# Altium schematic sheet BSPD.SchDoc: BSPD
size A3; DocumentNumber: 2; Revision: R5; SheetNumber: 2
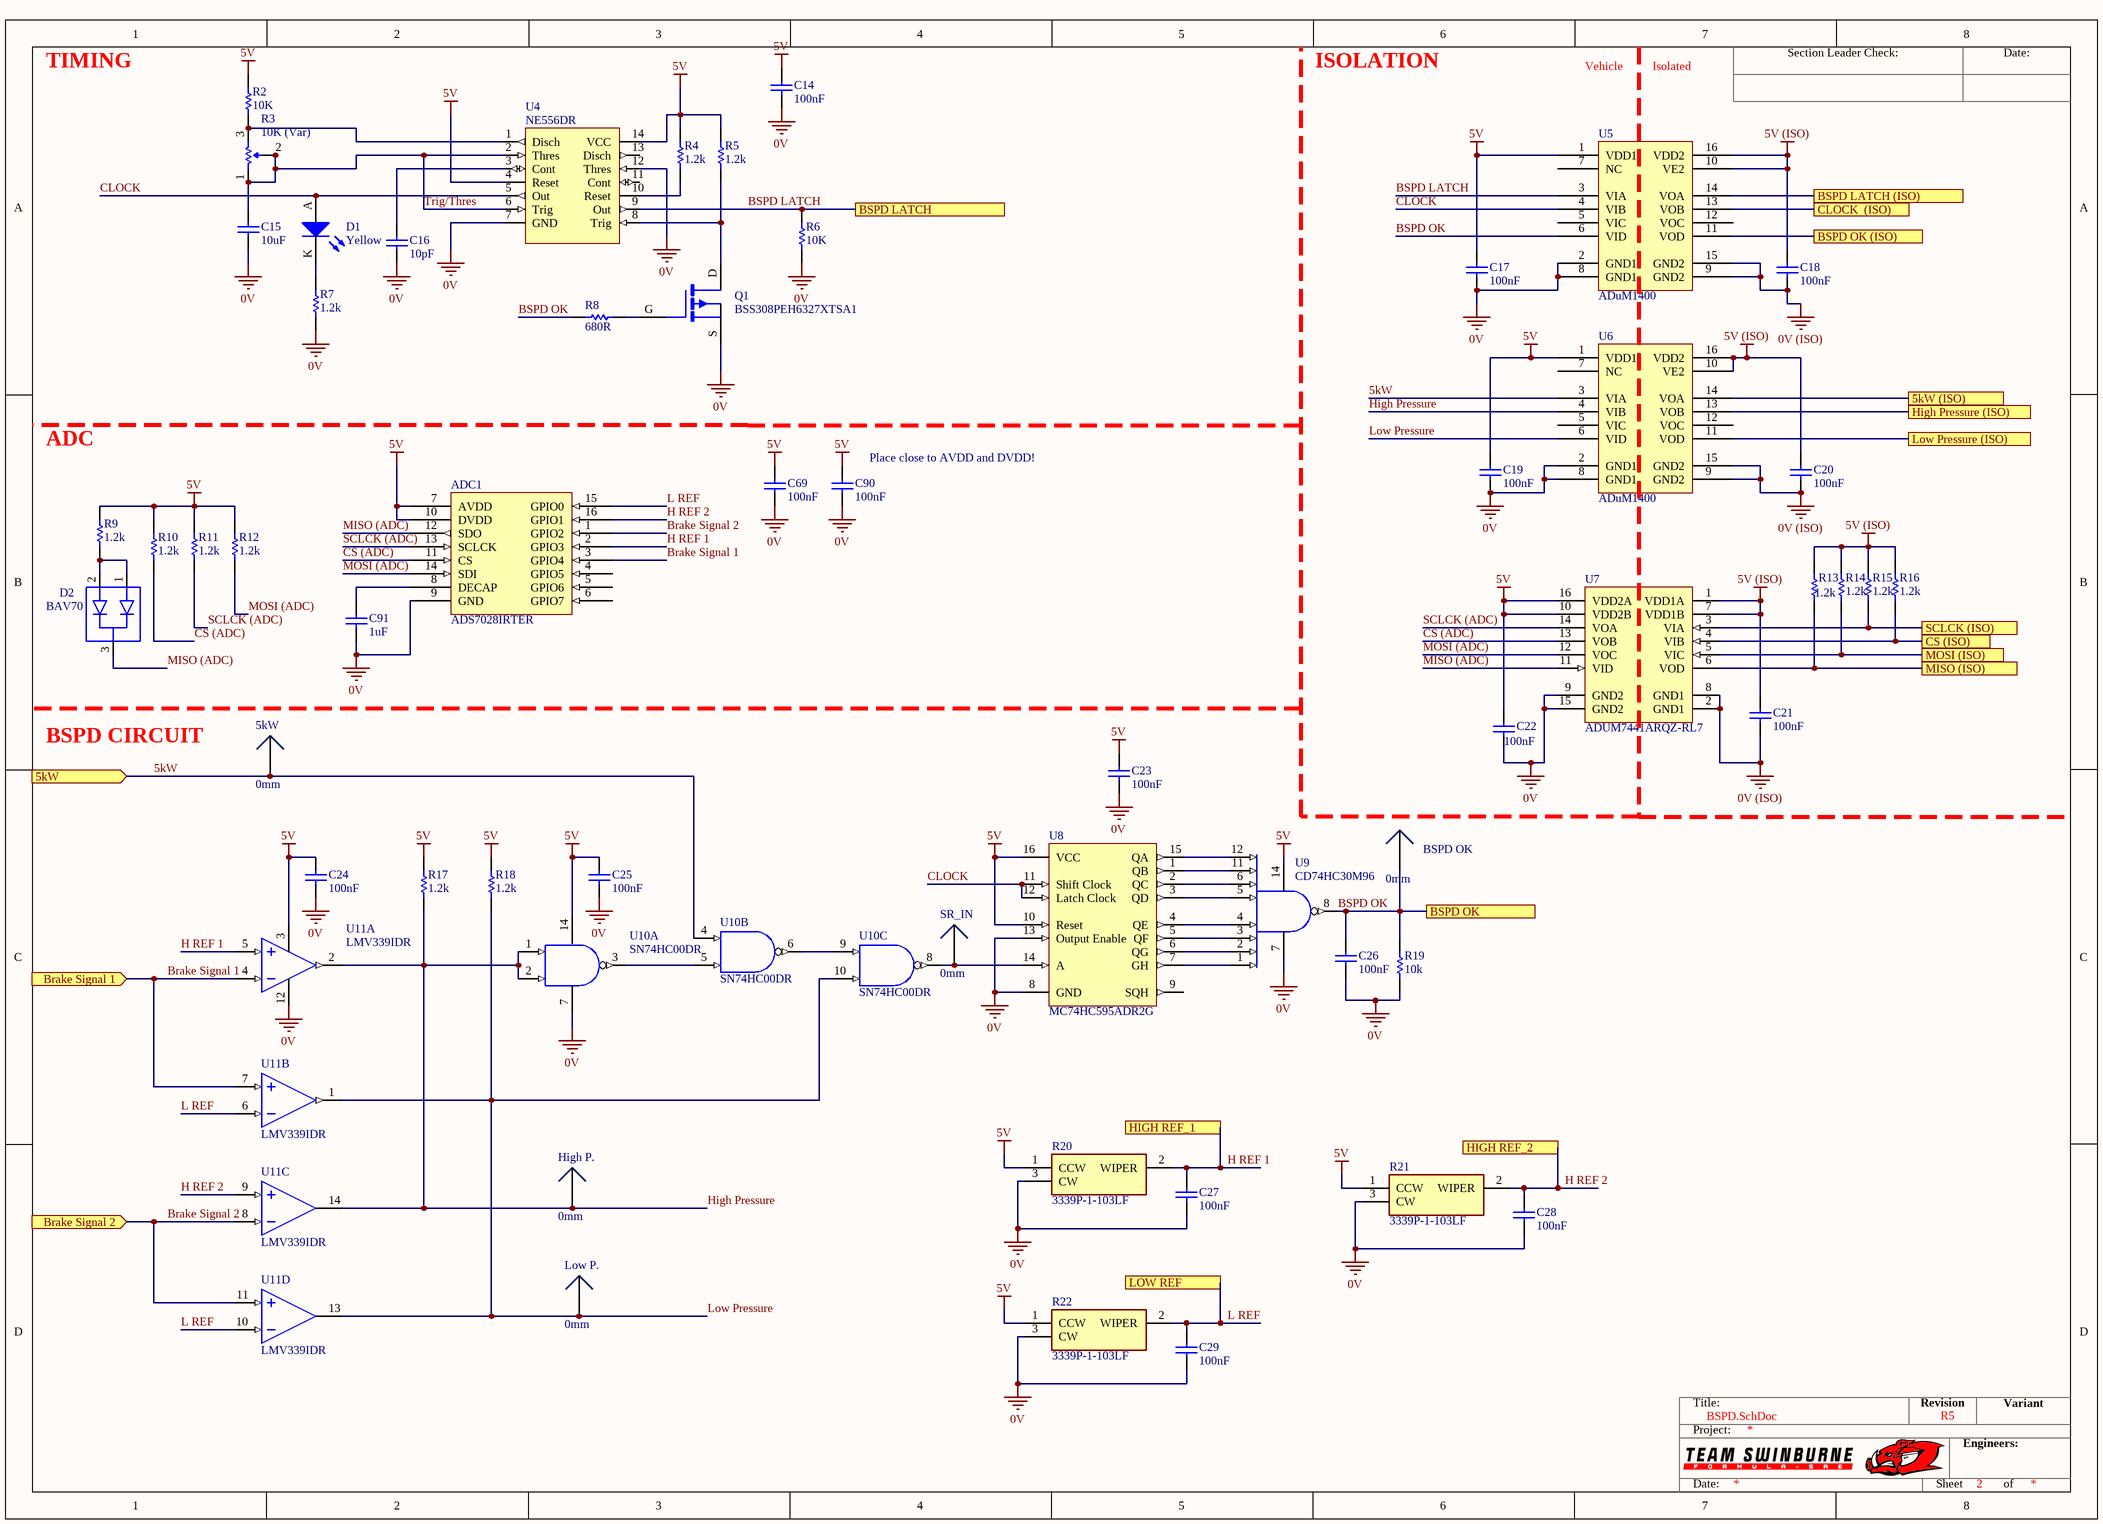
[diagram p0: BSPD.SchDoc]

## Parts
5kW  0mm  [SMD Test Point]
ADC1  ADS7028IRTER  [WFQN-16]
BSPD_OK  0mm  [SMD Test Point]
C14  100nF  [C0603]
C15  10uF  [C0603]
C16  10pF  [C0603]
C17  100nF  [C0603]
C18  100nF  [C0603]
C19  100nF  [C0603]
C20  100nF  [C0603]
C21  100nF  [C0603]
C22  100nF  [C0603]
C23  100nF  [C0603]
C24  100nF  [C0603]
C25  100nF  [C0603]
C26  100nF  [C0603]
C27  100nF  [0805]
C28  100nF  [0805]
C29  100nF  [0805]
C69  100nF  [C0603]
C90  100nF  [C0603]
C91  1uF  [0603]
D1  Yellow  [0805 LED]
D2  BAV70  [BAV70-Footprint-1]
High_P.  0mm  [SMD Test Point]
Low_P.  0mm  [SMD Test Point]
Q1  BSS308PEH6327XTSA1  [IN SOT-23 MOSFET]
R2  10K  [R0603]
R3  10K (Var)  [B 3296]
R4  1.2k  [R0603]
R5  1.2k  [R0603]
R6  10K  [R0603]
R7  1.2k  [R0603]
R8  680R  [R0603]
R9  1.2k  [R0603]
R10  1.2k  [R0603]
R11  1.2k  [R0603]
R12  1.2k  [R0603]
R13  1.2k  [R0603]
R14  1.2k  [R0603]
R15  1.2k  [R0603]
R16  1.2k  [R0603]
R17  1.2k  [R0603]
R18  1.2k  [R0603]
R19  10k  [0805]
R20  3339P-1-103LF  [3339P1103LF]
R21  3339P-1-103LF  [3339P1103LF]
R22  3339P-1-103LF  [3339P1103LF]
SR_IN  0mm  [SMD Test Point]
U4  NE556DR  [14 SOIC]
U5  ADuM1400  [SOIC16-W]
U6  ADuM1400  [SOIC16-W]
U7  ADUM7441ARQZ-RL7  [ADI-RQ-16_M]
U8  MC74HC595ADR2G  [ON 16-SOIC]
U9  CD74HC30M96  [TI 14-SOIC]
U10  SN74HC00DR  [TI 14-SOIC]  (parts A,B,C of 4)
U11  LMV339IDR  [TI 14-SOIC]  (parts A,B,C,D of 4)

## Ports
5kW (in), 5kW (ISO), Brake Signal 1 (in), Brake Signal 2 (in), BSPD LATCH, BSPD LATCH (ISO), BSPD OK, BSPD OK (ISO), CLOCK  (ISO), CS (ISO), High Pressure (ISO), HIGH REF_1, HIGH REF_2, Low Pressure (ISO), LOW REF, MISO (ISO), MOSI (ISO), SCLCK (ISO)

## Nets
0V: ADC1.9(GND) C14.1 C15.1 C16.1 C17.1 C19.1 C22.1 C23.1 C24.1 C25.1 C26.1 C27.1 C28.1 C29.1 C69.1 C90.1 C91.1 Q1.S R6.1 R7.1 R19.1 R20.3(CW) R21.3(CW) R22.3(CW) U4.7(GND) U4.12(Thres) U5.2(GND1) U5.8(GND1) U6.2(GND1) U6.8(GND1) U7.9(GND2) U7.15(GND2) U8.8(GND) U8.13(Output_Enable) U9.7(GND) U10.7(GND) U11.12(V-)
0V (ISO): C18.1 C20.1 C21.1 U5.9(GND2) U5.15(GND2) U6.9(GND2) U6.15(GND2) U7.2(GND1) U7.8(GND1)
5V: ADC1.7(AVDD) ADC1.10(DVDD) C14.2 C17.2 C19.2 C22.2 C23.2 C24.2 C25.2 C69.2 C90.2 R2.2 R4.2 R5.2 R9.2 R10.2 R11.2 R12.2 R17.2 R18.2 R20.1(CCW) R21.1(CCW) R22.1(CCW) U4.4(Reset) U4.14(VCC) U5.1(VDD1) U6.1(VDD1) U7.10(VDD2B) U7.16(VDD2A) U8.10(Reset) U8.16(VCC) U9.14(VCC) U10.14(VCC) U11.3(V+)
5V (ISO): C18.2 C20.2 C21.2 R13.2 R14.2 R15.2 R16.2 U5.10(VE2) U5.16(VDD2) U6.10(VE2) U6.16(VDD2) U7.1(VDD1A) U7.7(VDD1B)
5kW: 5kW.1 U6.3(VIA) U10.4(2A) ; port 5kW
5kW (ISO): U6.14(VOA) ; port 5kW (ISO)
Brake Signal 1: ADC1.3(GPIO4) U11.4(IN_A-) U11.7(IN_B+) ; port Brake Signal 1
Brake Signal 2: ADC1.1(GPIO2) U11.8(IN_C-) U11.11(IN_D+) ; port Brake Signal 2
BSPD LATCH: R6.2 U4.9(Out) U5.3(VIA) ; port BSPD LATCH
BSPD LATCH (ISO): U5.14(VOA) ; port BSPD LATCH (ISO)
BSPD OK: BSPD_OK.1 C26.2 R8.1 R19.2 U5.6(VID) U9.8(Output) ; port BSPD OK
BSPD OK (ISO): U5.11(VOD) ; port BSPD OK (ISO)
CLOCK: D1.A U4.5(Out) U5.4(VIB) U8.11(Shift_Clock) U8.12(Latch_Clock)
CLOCK  (ISO): U5.13(VOB) ; port CLOCK  (ISO)
CS (ADC): ADC1.11(CS) R10.1 U7.13(VOB)
CS (ISO): R16.1 U7.4(VIB) ; port CS (ISO)
H REF 1: ADC1.2(GPIO3) C27.2 R20.2(WIPER) U11.5(IN_A+) ; port HIGH REF_1
H REF 2: ADC1.16(GPIO1) C28.2 R21.2(WIPER) U11.9(IN_C+) ; port HIGH REF_2
High Pressure: High_P..1 R17.1 U6.4(VIB) U10.1(1A) U10.2(1B) U11.2(OUT_A) U11.14(OUT_C)
High Pressure (ISO): U6.13(VOB) ; port High Pressure (ISO)
L REF: ADC1.15(GPIO0) C29.2 R22.2(WIPER) U11.6(IN_B-) U11.10(IN_D-) ; port LOW REF
Low Pressure: Low_P..1 R18.1 U6.6(VID) U10.10(3B) U11.1(OUT_B) U11.13(OUT_D)
Low Pressure (ISO): U6.11(VOD) ; port Low Pressure (ISO)
MISO (ADC): ADC1.12(SDO) D2.3(CC) U7.11(VID)
MISO (ISO): R13.1 U7.6(VOD) ; port MISO (ISO)
MOSI (ADC): ADC1.14(SDI) R12.1 U7.12(VOC)
MOSI (ISO): R14.1 U7.5(VIC) ; port MOSI (ISO)
SCLCK (ADC): ADC1.13(SCLCK) R11.1 U7.14(VOA)
SCLCK (ISO): R15.1 U7.3(VIA) ; port SCLCK (ISO)
Trig/Thres: C15.2 R3.1(CCW) R3.2(Wiper) U4.2(Thres) U4.6(Trig)
NetADC1_8: ADC1.8(DECAP) C91.2
NetC16_2: C16.2 U4.3(Cont)
NetD1_K: D1.K R7.2
NetD2_1: D2.1(A1) D2.2(A2) R9.1
NetQ1_D: Q1.D R5.1 U4.8(Trig)
NetQ1_G: Q1.G R8.2
NetR2_1: R2.1 R3.3(CW) U4.1(Disch)
NetR4_1: R4.1 U4.10(Reset)
NetSR_IN_1: SR_IN.1 U8.14(A) U10.8(3Y)
NetU8_1: U8.1(QB) U9.11(Input)
NetU8_2: U8.2(QC) U9.6(Input)
NetU8_3: U8.3(QD) U9.5(Input)
NetU8_4: U8.4(QE) U9.4(Input)
NetU8_5: U8.5(QF) U9.3(Input)
NetU8_6: U8.6(QG) U9.2(Input)
NetU8_7: U8.7(GH) U9.1(Input)
NetU8_15: U8.15(QA) U9.12(Input)
NetU10_3: U10.3(1Y) U10.5(2B)
NetU10_6: U10.6(2Y) U10.9(3A)

Not connected (* = marked no-connect by the designer): ADC1 4(GPIO5) 5(GPIO6) 6(GPIO7); U4 11(Cont) 13(Disch); U5 5(VIC) 7(NC) 12(VOC); U6 5(VIC) 7(NC) 12(VOC); U8 9(SQH)

## Notes on the sheet
- TIMING
- ISOLATION
- Vehicle
- Isolated
- ADC
- (near C90) Place close to AVDD and DVDD!
- BSPD CIRCUIT
- Section Leader Check:
- Date:
- Title:
- Revision
- Variant
- Project:
- Engineers:
- Sheet
- of

## Library data of the parts
5kW BSPD_OK High_P. Low_P. SR_IN = SMD Test Point: Positions: 1; Row Spacing: 0; Flange: No; Contact: NA; Part Number: SMD Test Point; Pitch: 0mm; Angle: 0
ADC1 = ADS7028IRTER: IC ADC 12BIT SAR 16WQFN; Manufacturer: Texas Instruments; Part Number: ADS7028IRTER; Digikey Part Number: ADS7028IRTER; Digikey Link: https://www.digikey.com.au/en/products/detail/texas-instruments/ADS7028IRTER/12696020?s=N4IgTCBcDaIIIBEDKB2ADGAHASQEoBUBRXEAXQF8g
C14 C17-C26 C69 C90 = CC0603ZPY5V9BB104: Tolerance: 5%; Material: C0G; Rated Voltage: 50V; Part Number: CC0603ZPY5V9BB104; Value: 100nF; Digikey Link: #https://www.digikey.com.au/en/products/detail/yageo/CC0603ZPY5V9BB104/11490657#
C15 = GRM188R6YA106MA73D: Tolerance: 20%; Material: X5R; Rated Voltage: 35V; Part Number: GRM188R6YA106MA73D; Value: 10uF; Digikey Link: #https://www.digikey.com.au/en/products/detail/murata-electronics/GRM188R6YA106MA73D/5877411#
C16 = CC0603JPNPO9BN100: Tolerance: 5%; Material: C0G; Rated Voltage: 50V; Part Number: CC0603JPNPO9BN100; Value: 10pF; Digikey Link: #https://www.digikey.com.au/en/products/detail/yageo/CC0603JPNPO9BN100/11491009#
C27-C29 = GCM21BR71H104KA37L: Manufacturer: muRata; Tolerance: ±10%; Material: X7R; Rated Voltage: 50V; Part Number: GCM21BR71H104KA37L; Value: 100nF; Digikey Part Number: 490-6064-1-ND
C91 = GRT188R61H105ME13D: Manufacturer: muRata; Tolerance: 20%; Material: X5R; Rated Voltage: 50V; Part Number: GRT188R61H105ME13D; Value: 1uF; Digikey Part Number: GRT188R61H105ME13D
D1 = SML-211YTT86: Yellow LED Indication - Discrete 1.75V 0805 (2012 Metric); Manufacturer: ROHM Semiconductor; Part Number: SML-211YTT86; Colour: Yellow; Digikey Part Number: 511-1293-1-ND; Digikey Link: https://www.digikey.com/product-detail/en/rohm-semiconductor/SML-211YTT86/511-1293-1-ND/637106
D2 = CMP-004-00001-1: DIODE ARRAY GP 70V 200mA SOT23-3; RoHS Compliant: No
Q1 = BSS308PEH6327XTSA1: P-Channel 30V 2A (Ta) 500mW (Ta) Surface Mount SOT-23-3; Manufacturer: Infineon Technologies; Published: 24-Mar-1999; LatestRevisionDate: 29-May-2009; LatestRevisionNote: IPC-7351 Footprint Added.; PackageVersion: Sep-2000; PackageReference: SOT-343; Publisher: Altium Limited; PackageDescription: 4-Pin SOT-343 Package 1.3 mm Pitch, 2.1 mm Lead Span; Part Number: BSS308PEH6327XTSA1; Digikey Part Number: BSS308PEH6327XTSA1CT-ND; Digikey Link: https://www.digikey.com/product-detail/en/infineon-technologies/BSS308PEH6327XTSA1/BSS308PEH6327XTSA1CT-ND/3196649
R2 R6 = RA73F1J10KBTD: Tolerance: 0.1%; Part Number: RA73F1J10KBTD; Value: 10K; Material: Thin Film; Digikey Link: #https://www.digikey.com.au/en/products/detail/te-connectivity-passive-product/RA73F1J10KBTD/16031729#
R3 = 3296W-1-103LF: Manufacturer: Bournes Inc; Tolerance: 0.1; Rated Voltage: 0.5W; Part Number: 3296W-1-103LF; Value: 10K (Var); Digikey Part Number: 3296W-103LF-ND
R4 R5 R7 R9-R18 = ERJ-PA3J122V: Tolerance: 1%; Part Number: ERJ-PA3J122V; Value: 1.2k; Material: Thick Film; Digikey Link: #https://www.digikey.com.au/en/products/detail/panasonic-electronic-components/ERJ-PA3J122V/5035981#
R8 = RCP0603B680RGEA: Tolerance: 2%; Part Number: RCP0603B680RGEA; Value: 680R; Material: Thick Film; Digikey Link: #https://www.digikey.com.au/en/products/detail/vishay-dale/RCP0603B680RGEA/5791729#
R19 = RC0805FR0710KL: Manufacturer: YAGEO; Tolerance: 0.01; Rated Voltage: 0.125W; Part Number: RC0805FR0710KL; Value: 10k; Material: FR-07; Digikey Part Number: 311-10.0KCRCT-ND
R20-R22 = 3339P-1-103LF: Variable Resistor; Manufacturer_Name: Bourns; Datasheet Link: http://www.bourns.com/docs/Product-Datasheets/3339.pdf; Height: 6.6mm; Manufacturer_Part_Number: 3339P-1-103LF; Mouser Part Number: 652-3339P-1-103LF; Mouser Price/Stock: https://www.mouser.co.uk/ProductDetail/Bourns/3339P-1-103LF?qs=pSi0RBzb0oq3DckZs1IQyg%3D%3D; Arrow Part Number: 3339P-1-103LF; Arrow Price/Stock: https://www.arrow.com/en/products/3339p-1-103lf/bourns?region=nac
U4 = NE556DR: IC OSC TIMER DUAL 100KHZ 14SOIC; Manufacturer: Texas Instruments; Part Number: NE556DR; Digikey Part Number: 296-26240-1-ND; Digikey Link: https://www.digikey.com/product-detail/en/texas-instruments/NE556DR/296-26240-1-ND/2254905
U5 U6 = ADuM1400: DIGITAL ISOLATOR, QUAD CHANNEL; Part Number: ADuM1400; Digikey Link: #https://www.analog.com/media/en/technical-documentation/data-sheets/ADuM1400_1401_1402.pdf#
U7 = CMP-001-0005-5: Digital Isolator CMOS 4-CH 1Mbps 16-Pin QSOP T/R; Pulse Width Distortion (PWD): 25ns; Nominal Supply Current: 4.1mA; Data Rate: 25Mbps; Turn-On Delay Time: 56ns; Max Supply Voltage: 5.5V; Isolated Power: No; Min Supply Voltage: 3V; Propagation Delay: 75ns; Channel Type: Unidirectional; Number of Channels: 4; Lead Free: Contains Lead; Number of Pins: 16; Contact Plating: Tin,Matte; RoHS Compliant: Yes; Package Quantity: 1000; Type: General Purpose; Supply Current: 4.1mA; Case/Package: QSOP; Max Operating Temperature: 105°C; Packaging: Tape and Reel; Series: iCoupler®; Min Operating Temperature: -40°C
U8 = MC74HC595ADR2G: IC SHIFT REGISTR 8BIT 3ST 16SOIC; Manufacturer: ON Semiconductor; Part Number: MC74HC595ADR2G; Digikey Part Number: MC74HC595ADR2GOSCT-ND; Digikey Link: https://www.digikey.com/product-detail/en/on-semiconductor/MC74HC595ADR2G/MC74HC595ADR2GOSCT-ND/1139727
U9 = CD74HC30M96: IC GATE NAND 1CH 8-INP 14SOIC; Manufacturer: Texas Instruments; Part Number: CD74HC30M96; Digikey Part Number: 296-14521-1-ND; Digikey Link: https://www.digikey.com/product-detail/en/texas-instruments/CD74HC30M96/296-14521-1-ND/555580
U10 = SN74HC00DR: NAND Gate IC 4 Channel 14-SOIC; Manufacturer: Texas Instruments; Part Number: SN74HC00DR; Digikey Part Number: 296-1187-2-ND; Digikey Link: https://www.digikey.com.au/product-detail/en/texas-instruments/SN74HC00DR/296-1187-2-ND/276830
U11 = LMV339IDR: Comparator General Purpose Open Collector 14-SOIC; Manufacturer: Texas Instruments; Part Number: LMV339IDR; Digikey Part Number: 296-6611-2-ND; Digikey Link: https://www.digikey.com/product-detail/en/texas-instruments/LMV339MTX-NOPB/296-35446-1-ND/3739150